# Altium project Electro_plant.PrjPcb
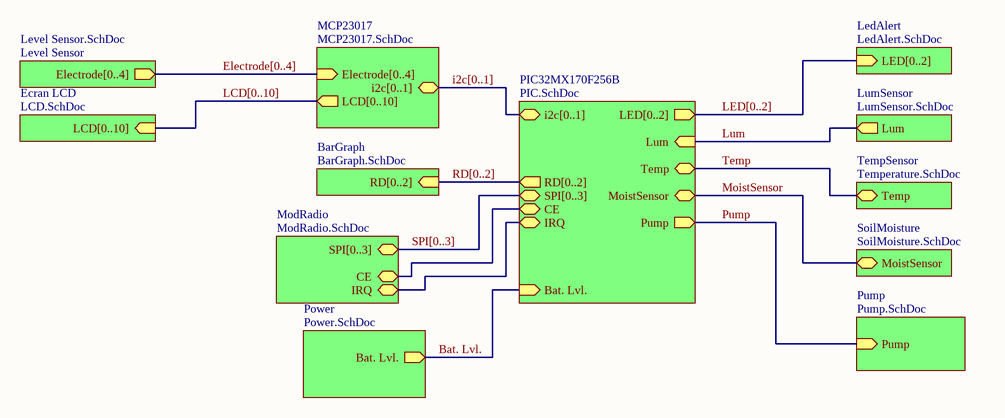
[diagram p0: ElectroPlantoE.SchDoc]
13 sheets, 82 parts. Net scope: hierarchical (ports join the sheet entries above them; power ports are global).
Board file: PCB1.PcbDoc
Sheets:
  ElectroPlantoE.SchDoc
    PIC32MX170F256B = PIC.SchDoc
    LedAlert = LedAlert.SchDoc
    LumSensor = LumSensor.SchDoc
    TempSensor = Temperature.SchDoc
    MCP23017 = MCP23017.SchDoc
    Level Sensor = Level Sensor.SchDoc
    Ecran LCD = LCD.SchDoc
    BarGraph = BarGraph.SchDoc
    SoilMoisture = SoilMoisture.SchDoc
    ModRadio = ModRadio.SchDoc
    Pump = Pump.SchDoc
    Power = Power.SchDoc

## Sheet ElectroPlantoE.SchDoc
size A

### Sub-sheets
BarGraph = BarGraph.SchDoc: RD[0..2] (in)
Ecran LCD = LCD.SchDoc: LCD[0..10] (in)
LedAlert = LedAlert.SchDoc: LED[0..2] (in)
Level Sensor = Level Sensor.SchDoc: Electrode[0..4] (out)
LumSensor = LumSensor.SchDoc: Lum (out)
MCP23017 = MCP23017.SchDoc: i2c[0..1] (bidir), Electrode[0..4] (in), LCD[0..10] (out)
ModRadio = ModRadio.SchDoc: SPI[0..3], CE, IRQ
PIC32MX170F256B = PIC.SchDoc: LED[0..2] (out), Lum (in), Temp (bidir), i2c[0..1] (bidir), RD[0..2] (out), MoistSensor (bidir), Pump (out), SPI[0..3], CE, Bat. Lvl. (in), IRQ
Power = Power.SchDoc: Bat. Lvl. (out)
Pump = Pump.SchDoc: Pump (in)
SoilMoisture = SoilMoisture.SchDoc: MoistSensor (bidir)
TempSensor = Temperature.SchDoc: Temp (bidir)

### Nets
Bat. Lvl.: sheet PIC32MX170F256B/Bat. Lvl., sheet Power/Bat. Lvl.
CE: sheet PIC32MX170F256B/CE, sheet ModRadio/CE
Lum: sheet PIC32MX170F256B/Lum, sheet LumSensor/Lum
MoistSensor: sheet PIC32MX170F256B/MoistSensor, sheet SoilMoisture/MoistSensor
Pump: sheet PIC32MX170F256B/Pump, sheet Pump/Pump
Temp: sheet PIC32MX170F256B/Temp, sheet TempSensor/Temp
NetU4_8: sheet PIC32MX170F256B/IRQ, sheet ModRadio/IRQ

### Buses and harness runs
bus Electrode[0..4] = sheet Level Sensor/Electrode[0..4] = sheet MCP23017/Electrode[0..4]
bus i2c[0..1] = sheet MCP23017/i2c[0..1] = sheet PIC32MX170F256B/i2c[0..1]
bus LCD[0..10] = sheet Ecran LCD/LCD[0..10] = sheet MCP23017/LCD[0..10]
bus LED[0..2] = sheet LedAlert/LED[0..2] = sheet PIC32MX170F256B/LED[0..2]
bus RD[0..2] = sheet BarGraph/RD[0..2] = sheet PIC32MX170F256B/RD[0..2]
bus SPI[0..3] = sheet ModRadio/SPI[0..3] = sheet PIC32MX170F256B/SPI[0..3]

## Sheet PIC.SchDoc
size A
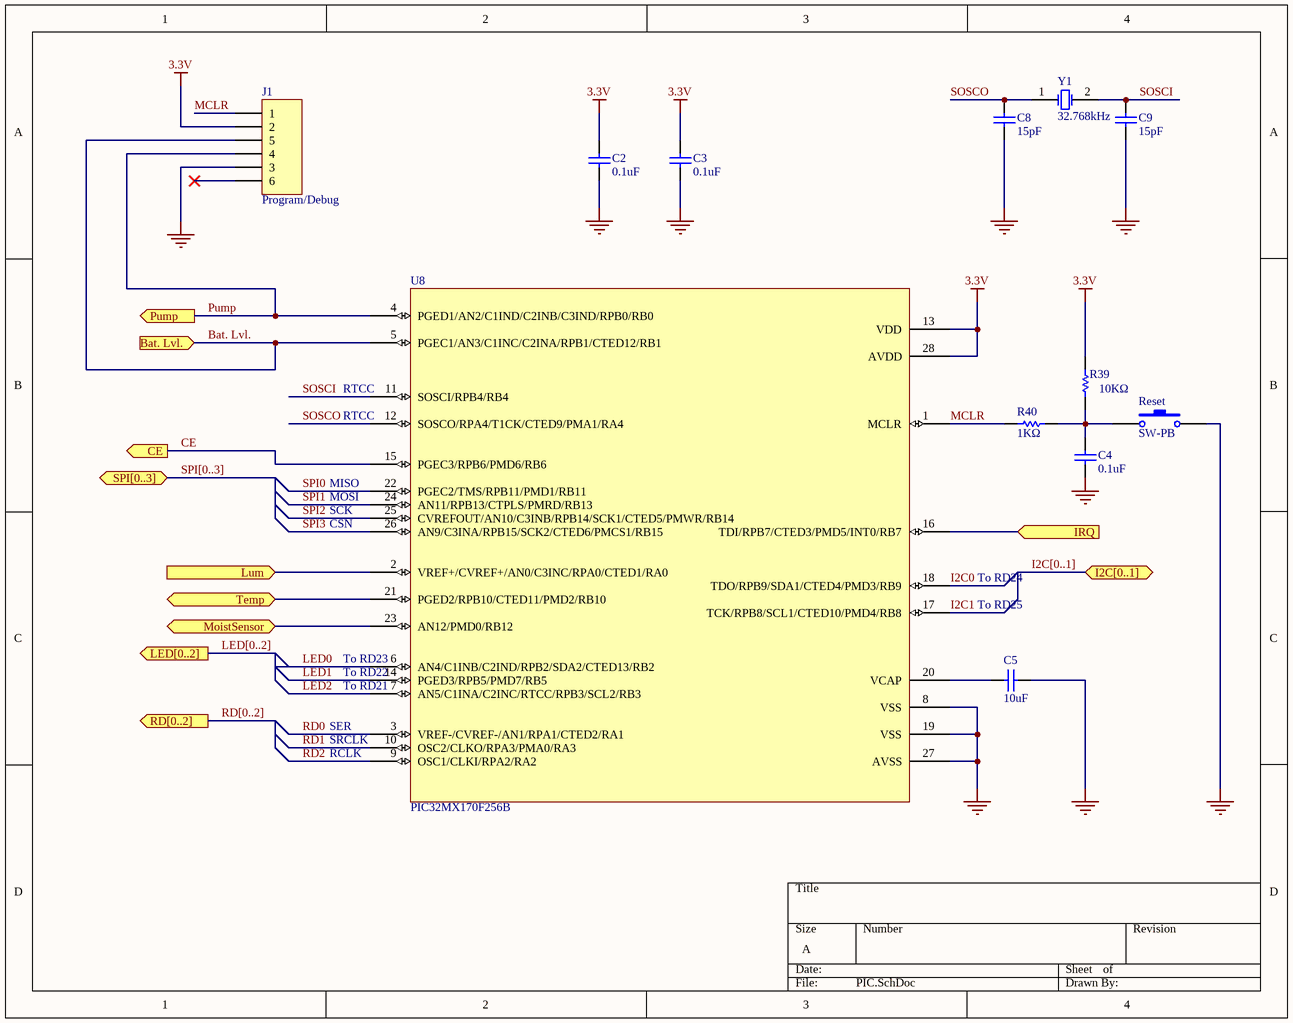
[diagram p1: PIC.SchDoc]

### Parts
C2  0.1uF  [C0603]
C3  0.1uF  [C0603]
C4  0.1uF  [C0603]
C5  10uF  [C0603]
C8  15pF  [C0603]
C9  15pF  [C0603]
J1  Program/Debug  [HDR1X6]
R39  10KΩ  [R0603]
R40  1KΩ  [R0603]
Reset  SW-PB  [Reset]
U8  PIC32MX170F256B  [PIC32MX170F256B]
Y1  32.768kHz  [XTAL]

### Ports
Bat. Lvl. (in), CE (out), I2C[0..1] (bidir), IRQ (in), LED[0..2] (out), Lum (in), MoistSensor (bidir), Pump (out), RD[0..2] (out), SPI[0..3] (bidir), Temp (bidir)

### Nets
3.3V: C2.2 C3.2 J1.2 R39.2 U8.13(VDD) U8.28(AVDD)
GND: C2.1 C3.1 C4.1 C5.2 C8.1 C9.1 J1.3 Reset.2 U8.8(VSS) U8.19(VSS) U8.27(AVSS)
Bat. Lvl.: J1.5 U8.5(PGEC1/AN3/C1INC/C2INA/RPB1/CTED12/RB1) ; port Bat. Lvl.
CE: U8.15(PGEC3/RPB6/PMD6/RB6) ; port CE
I2C0: U8.18(TDO/RPB9/SDA1/CTED4/PMD3/RB9)
I2C1: U8.17(TCK/RPB8/SCL1/CTED10/PMD4/RB8)
LED0: U8.6(AN4/C1INB/C2IND/RPB2/SDA2/CTED13/RB2)
LED1: U8.14(PGED3/RPB5/PMD7/RB5)
LED2: U8.7(AN5/C1INA/C2INC/RTCC/RPB3/SCL2/RB3)
Lum: U8.2(VREF+/CVREF+/AN0/C3INC/RPA0/CTED1/RA0) ; port Lum
MCLR: J1.1 R40.2 U8.1(MCLR)
MoistSensor: U8.23(AN12/PMD0/RB12) ; port MoistSensor
Pump: J1.4 U8.4(PGED1/AN2/C1IND/C2INB/C3IND/RPB0/RB0) ; port Pump
RD0: U8.3(VREF-/CVREF-/AN1/RPA1/CTED2/RA1)
RD1: U8.10(OSC2/CLKO/RPA3/PMA0/RA3)
RD2: U8.9(OSC1/CLKI/RPA2/RA2)
SOSCI: C9.2 U8.11(SOSCI/RPB4/RB4) Y1.2(OSC2)
SOSCO: C8.2 U8.12(SOSCO/RPA4/T1CK/CTED9/PMA1/RA4) Y1.1(OSC1)
SPI0: U8.22(PGEC2/TMS/RPB11/PMD1/RB11)
SPI1: U8.24(AN11/RPB13/CTPLS/PMRD/RB13)
SPI2: U8.25(CVREFOUT/AN10/C3INB/RPB14/SCK1/CTED5/PMWR/RB14)
SPI3: U8.26(AN9/C3INA/RPB15/SCK2/CTED6/PMCS1/RB15)
Temp: U8.21(PGED2/RPB10/CTED11/PMD2/RB10) ; port Temp
NetC4_2: C4.2 R39.1 R40.1 Reset.1
NetC5_1: C5.1 U8.20(VCAP)
NetU4_8: U8.16(TDI/RPB7/CTED3/PMD5/INT0/RB7) ; port IRQ

Not connected (* = marked no-connect by the designer): J1 6*

### Buses and harness runs
bus I2C[0..1] = port I2C[0..1]
bus LED[0..2] = port LED[0..2]
bus RD[0..2] = port RD[0..2]
bus SPI[0..3] = port SPI[0..3]

### Notes on the sheet
- (near U8) RTCC
- MISO
- MOSI
- SCK
- CSN
- To RD24
- To RD25
- (near U8) To RD21
- (near U8) To RD22
- (near U8) To RD23
- SER
- RCLK
- (near U8) SRCLK

### Library data of the parts
C2-C4 = Cap: Capacitor; Manufacturer: MURATA; Ref.Manufacturer: GRM188R71H104KA93; Value: 100pF; Published: 8-Jun-2000; LatestRevisionDate: 17-Jul-2002; LatestRevisionNote: Re-released for DXP Platform.; PackageReference: RAD-0.3; Publisher: Altium Limited; PackageDescription: Radial Cap, Thru-Hole; 2 Leads; 0.3 in Pin Spacing; Ref.Farnell: 8820023; Supplier: Farnell
C5 = Cap: Capacitor; Manufacturer: MURATA; Ref.Manufacturer: GRM188D71A106MA73; Value: 100pF; Published: 8-Jun-2000; LatestRevisionDate: 17-Jul-2002; LatestRevisionNote: Re-released for DXP Platform.; PackageReference: RAD-0.3; Publisher: Altium Limited; PackageDescription: Radial Cap, Thru-Hole; 2 Leads; 0.3 in Pin Spacing; Ref.Farnell: 2611920; Supplier: Farnell
C8 C9 = Cap: Capacitor; Manufacturer: MURATA; Ref.Manufacturer: GRM1885C1H150JA01; Value: 27pF; Published: 8-Jun-2000; LatestRevisionDate: 17-Jul-2002; LatestRevisionNote: Re-released for DXP Platform.; PackageReference: RAD-0.3; Publisher: Altium Limited; PackageDescription: Radial Cap, Thru-Hole; 2 Leads; 0.3 in Pin Spacing; Ref.Farnell: 8819823; Supplier: Farnell
J1 = Header 6: Header, 6-Pin; LatestRevisionDate: 17-Jul-2002; LatestRevisionNote: Re-released for DXP Platform.; Publisher: Altium Limited; Supplier: Farnell
R39 = Res1: Resistor; Manufacturer: MULTICOMP; Ref.Manufacturer: MC0063W0603110K; Value: 1K; Published: 8-Jun-2000; LatestRevisionDate: 17-Jul-2002; LatestRevisionNote: Re-released for DXP Platform.; PackageReference: AXIAL-0.3; Publisher: Altium Limited; PackageDescription: Axial Device, Thru-Hole; 2 Leads; 0.3 in Pin Spacing; Ref.Farnell: 9330399; Supplier: Farnell
R40 = Res1: Resistor; Manufacturer: MULTICOMP; Ref.Manufacturer: MC0063W060311K; Value: 1K; Published: 8-Jun-2000; LatestRevisionDate: 17-Jul-2002; LatestRevisionNote: Re-released for DXP Platform.; PackageReference: AXIAL-0.3; Publisher: Altium Limited; PackageDescription: Axial Device, Thru-Hole; 2 Leads; 0.3 in Pin Spacing; Ref.Farnell: 9330380; Supplier: Farnell
Reset = SW-PB: Switch; Manufacturer: ALCOSWITCH - TE CONNECTIVITY; Ref.Manufacturer: 1437566-3; Published: 24-Mar-1999; LatestRevisionDate: 17-Jul-2002; LatestRevisionNote: Re-released for DXP Platform.; PackageReference: SPST-2; Publisher: Altium Limited; PackageDescription: Switch; 2 Leads; Ref.Farnell: 2468741; Supplier: Farnell
U8 = PIC32MX170F256B: Pic; Manufacturer: MICROCHIP; Ref.Manufacturer: PIC32MX170F256B-I/SO; Ref.Farnell: 2449077; Supplier: Farnell
Y1 = XTAL: Crystal Oscillator; Manufacturer: ABRACON; Ref.Manufacturer: AB38T-32.768KHZ; Published: 8-Jun-2000; LatestRevisionDate: 17-Jul-2002; LatestRevisionNote: Re-released for DXP Platform.; PackageReference: R38; Publisher: Altium Limited; PackageDescription: Crystal, Thru-Hole; 2 Leads; Body 3.1 x 8.2 mm (Dia.xH); Ref.Farnell: 1611828; Supplier: Farnell

## Sheet LedAlert.SchDoc
size A
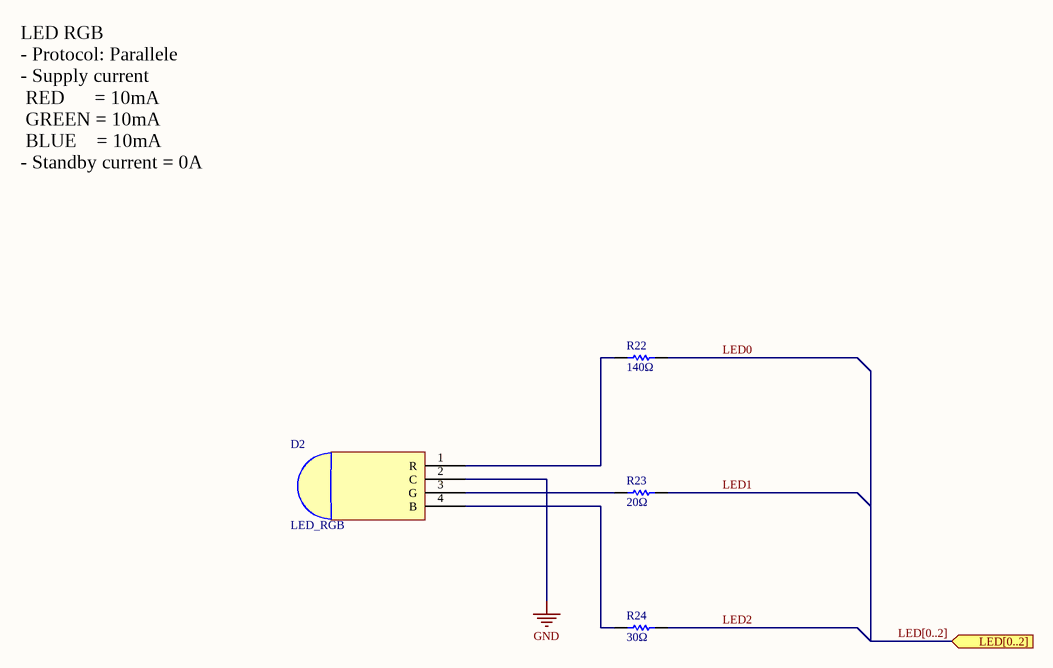
[diagram p2: LedAlert.SchDoc]

### Parts
D2  LED_RGB  [LED1]
R22  140Ω  [R0603]
R23  20Ω  [R0603]
R24  30Ω  [R0603]

### Ports
LED[0..2] (in)

### Nets
GND: D2.2(C)
LED0: R22.2
LED1: R23.2
LED2: R24.2
NetD2_1: D2.1(R) R22.1
NetD2_3: D2.3(G) R23.1
NetD2_4: D2.4(B) R24.1

### Buses and harness runs
bus LED[0..2] = port LED[0..2]

### Notes on the sheet
- LED RGB
  - Protocol: Parallele
  - Supply current
  RED      = 10mA
  GREEN = 10mA
  BLUE    = 10mA
  - Standby current = 0A

### Library data of the parts
D2 = LED_RGB: LedRGB; Manufacturer: KINGBRIGHT; Ref.Manufacturer: L-154A4SURKQBDZGW; Ref.Farnell: 2290374; Supplier: Farnell
R22 = Res1: Resistor; Manufacturer: MULTICOMP; Value: 1K; Published: 8-Jun-2000; LatestRevisionDate: 17-Jul-2002; LatestRevisionNote: Re-released for DXP Platform.; PackageReference: AXIAL-0.3; Publisher: Altium Limited; PackageDescription: Axial Device, Thru-Hole; 2 Leads; 0.3 in Pin Spacing; Ref.Farnell: ?; Supplier: Farnell
R23 = Res1: Resistor; Manufacturer: MULTICOMP; Ref.Manufacturer: MC0063W0603120R; Value: 1K; Published: 8-Jun-2000; LatestRevisionDate: 17-Jul-2002; LatestRevisionNote: Re-released for DXP Platform.; PackageReference: AXIAL-0.3; Publisher: Altium Limited; PackageDescription: Axial Device, Thru-Hole; 2 Leads; 0.3 in Pin Spacing; Ref.Farnell: 9330798; Supplier: Farnell
R24 = Res1: Resistor; Manufacturer: MULTICOMP; Ref.Manufacturer: MC0063W0603130R; Value: 1K; Published: 8-Jun-2000; LatestRevisionDate: 17-Jul-2002; LatestRevisionNote: Re-released for DXP Platform.; PackageReference: AXIAL-0.3; Publisher: Altium Limited; PackageDescription: Axial Device, Thru-Hole; 2 Leads; 0.3 in Pin Spacing; Ref.Farnell: 9331000; Supplier: Farnell

## Sheet LumSensor.SchDoc
size A
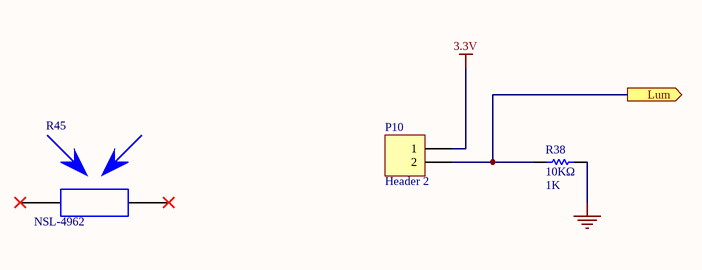
[diagram p3: LumSensor.SchDoc]

### Parts
P10  Header 2  [BORNIER]
R38  10KΩ  value 1K  [R0603]
R45  NSL-4962  [NSL-4962]

### Ports
Lum (out)

### Nets
3.3V: P10.1
GND: R38.2
Lum: P10.2 R38.1 ; port Lum

Not connected (* = marked no-connect by the designer): R45 1* 2*

### Library data of the parts
P10 = Header 2: Header, 2-Pin; Manufacturer: BUCHANAN - TE CONNECTIVITY; Ref.Manufacturer: 282834-2; LatestRevisionDate: 17-Jul-2002; LatestRevisionNote: Re-released for DXP Platform.; Publisher: Altium Limited; Ref.Farnell: 2112482; Supplier: Farnell
R38 = Res1: Resistor; Published: 8-Jun-2000; LatestRevisionDate: 17-Jul-2002; LatestRevisionNote: Re-released for DXP Platform.; PackageReference: AXIAL-0.3; Publisher: Altium Limited; PackageDescription: Axial Device, Thru-Hole; 2 Leads; 0.3 in Pin Spacing; Supplier: Farnell
R45 = NSL-4962: Ldr; Manufacturer: ADVANCED PHOTONIX; Ref.Manufacturer: NSL 4962.; Ref.Farnell: 3168359; Supplier: Farnell

## Sheet Temperature.SchDoc
size A
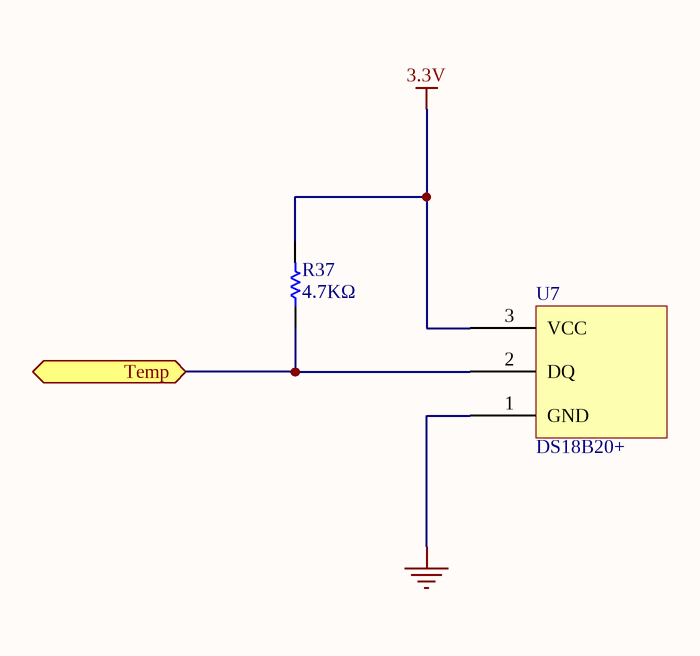
[diagram p4: Temperature.SchDoc]

### Parts
R37  4.7KΩ  [R0603]
U7  DS18B20+  [DS18B20+]

### Ports
Temp (bidir)

### Nets
3.3V: R37.2 U7.3(VCC)
GND: U7.1(GND)
Temp: R37.1 U7.2(DQ) ; port Temp

### Library data of the parts
R37 = Res1: Resistor; Manufacturer: MULTICOMP; Ref.Manufacturer: MC0063W060314K7; Value: 1K; Published: 8-Jun-2000; LatestRevisionDate: 17-Jul-2002; LatestRevisionNote: Re-released for DXP Platform.; PackageReference: AXIAL-0.3; Publisher: Altium Limited; PackageDescription: Axial Device, Thru-Hole; 2 Leads; 0.3 in Pin Spacing; Ref.Farnell: 9331247; Supplier: Farnell
U7 = DS18B20+: Temp; Manufacturer: MAXIM INTEGRATED PRODUCTS; Ref.Farnell: 2515553; Ref.Manufacturer: DS18B20+; Supplier: Farnell

## Sheet MCP23017.SchDoc
size A
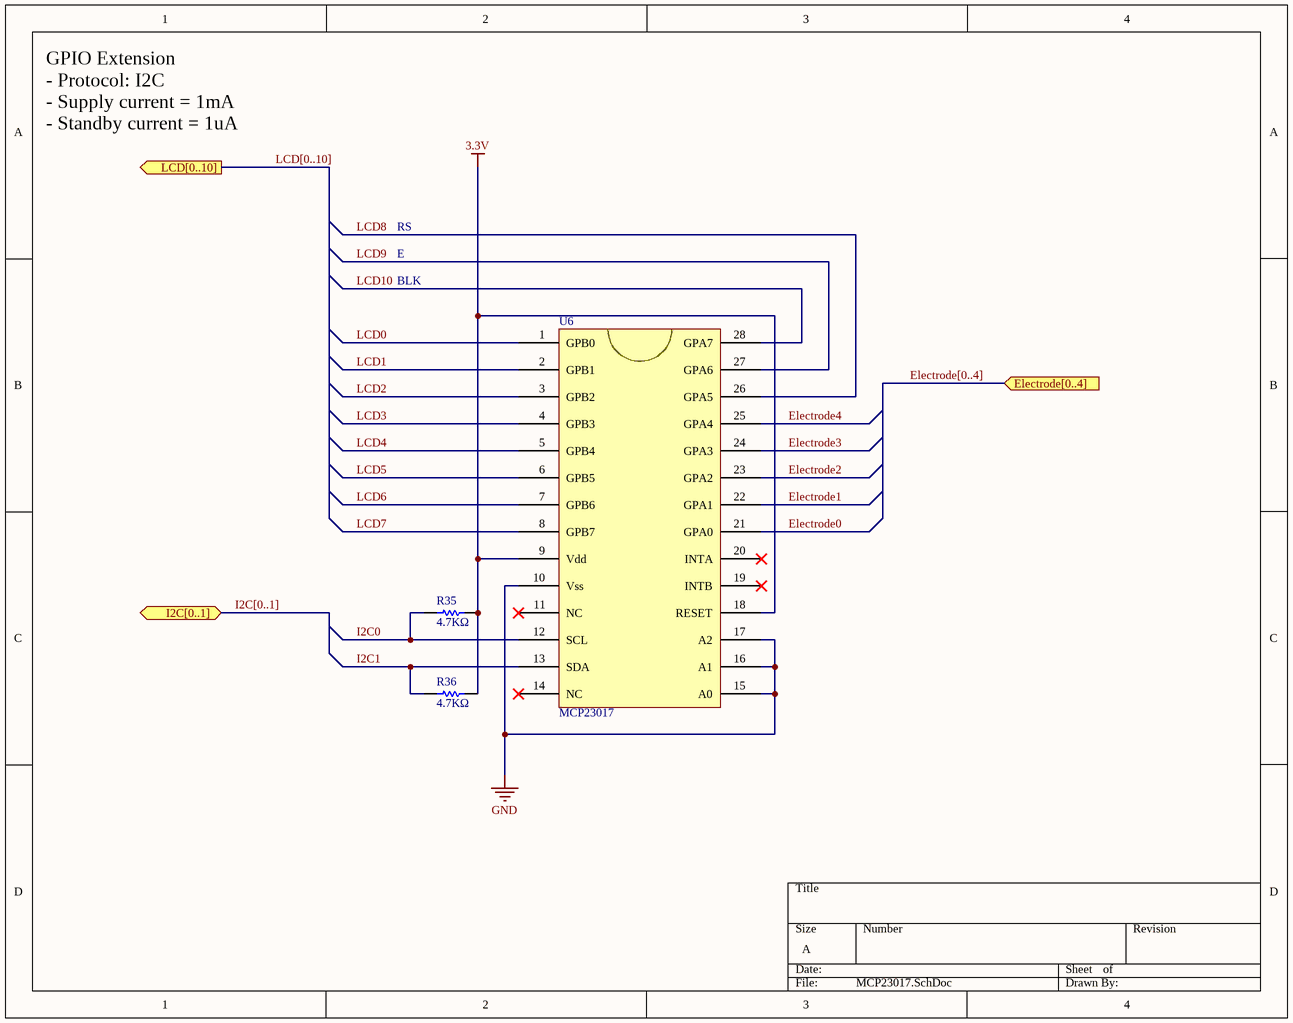
[diagram p5: MCP23017.SchDoc]

### Parts
R35  4.7KΩ  [R0603]
R36  4.7KΩ  [R0603]
U6  MCP23017  [MCP23017]

### Ports
Electrode[0..4] (in), I2C[0..1] (bidir), LCD[0..10] (out)

### Nets
3.3V: R35.2 R36.2 U6.9(Vdd) U6.18(RESET)
GND: U6.10(Vss) U6.15(A0) U6.16(A1) U6.17(A2)
Electrode0: U6.21(GPA0)
Electrode1: U6.22(GPA1)
Electrode2: U6.23(GPA2)
Electrode3: U6.24(GPA3)
Electrode4: U6.25(GPA4)
I2C0: R35.1 U6.12(SCL)
I2C1: R36.1 U6.13(SDA)
LCD0: U6.1(GPB0)
LCD1: U6.2(GPB1)
LCD2: U6.3(GPB2)
LCD3: U6.4(GPB3)
LCD4: U6.5(GPB4)
LCD5: U6.6(GPB5)
LCD6: U6.7(GPB6)
LCD7: U6.8(GPB7)
LCD8: U6.26(GPA5)
LCD9: U6.27(GPA6)
LCD10: U6.28(GPA7)

Not connected (* = marked no-connect by the designer): U6 11(NC)* 14(NC)* 19(INTB)* 20(INTA)*

### Buses and harness runs
bus Electrode[0..4] = port Electrode[0..4]
bus I2C[0..1] = port I2C[0..1]
bus LCD[0..10] = port LCD[0..10]

### Notes on the sheet
- GPIO Extension
  - Protocol: I2C
  - Supply current = 1mA
  - Standby current = 1uA
- RS
- E
- BLK

### Library data of the parts
R35 R36 = Res1: as R37 on sheet Temperature; Published: 8-Jun-2000; LatestRevisionDate: 17-Jul-2002; LatestRevisionNote: Re-released for DXP Platform.; PackageReference: AXIAL-0.3; Publisher: Altium Limited; PackageDescription: Axial Device, Thru-Hole; 2 Leads; 0.3 in Pin Spacing; Ref.Farnell: 9331247; Supplier: Farnell
U6 = MPC23017: GPIOExpander; Manufacturer: MICROCHIP; Ref.Manufacturer: MCP23017-E/SO; Ref.Farnell: 1332087; Supplier: Farnell

## Sheet Level Sensor.SchDoc
size A
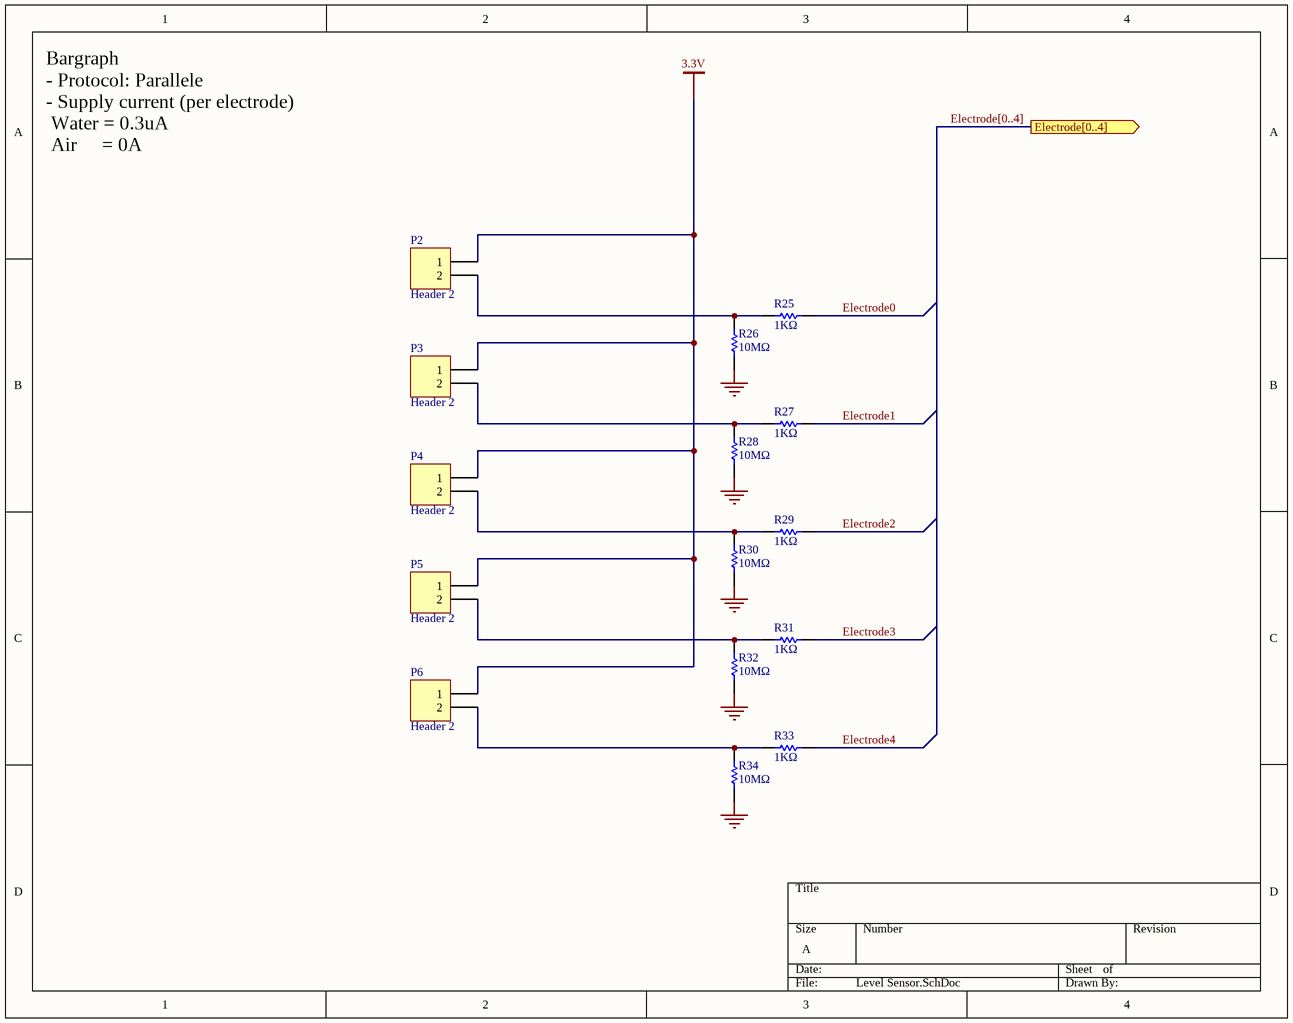
[diagram p6: Level Sensor.SchDoc]

### Parts
P2  Header 2  [BORNIER]
P3  Header 2  [BORNIER]
P4  Header 2  [BORNIER]
P5  Header 2  [BORNIER]
P6  Header 2  [BORNIER]
R25  1KΩ  [R0603]
R26  10MΩ  [R0603]
R27  1KΩ  [R0603]
R28  10MΩ  [R0603]
R29  1KΩ  [R0603]
R30  10MΩ  [R0603]
R31  1KΩ  [R0603]
R32  10MΩ  [R0603]
R33  1KΩ  [R0603]
R34  10MΩ  [R0603]

### Ports
Electrode[0..4] (out)

### Nets
3.3V: P2.1 P3.1 P4.1 P5.1 P6.1
GND: R26.1 R28.1 R30.1 R32.1 R34.1
Electrode0: R25.2
Electrode1: R27.2
Electrode2: R29.2
Electrode3: R31.2
Electrode4: R33.2
NetP2_2: P2.2 R25.1 R26.2
NetP3_2: P3.2 R27.1 R28.2
NetP4_2: P4.2 R29.1 R30.2
NetP5_2: P5.2 R31.1 R32.2
NetP6_2: P6.2 R33.1 R34.2

### Buses and harness runs
bus Electrode[0..4] = port Electrode[0..4]

### Notes on the sheet
- Bargraph
  - Protocol: Parallele
  - Supply current (per electrode)
  Water = 0.3uA
  Air     = 0A

### Library data of the parts
P2-P6 = Header 2: as P10 on sheet LumSensor; LatestRevisionDate: 17-Jul-2002; LatestRevisionNote: Re-released for DXP Platform.; Publisher: Altium Limited; Ref.Farnell: 2112482; Supplier: Farnell
R25 R27 R29 R31 R33 = Res1: as R40 on sheet PIC; Published: 8-Jun-2000; LatestRevisionDate: 17-Jul-2002; LatestRevisionNote: Re-released for DXP Platform.; PackageReference: AXIAL-0.3; Publisher: Altium Limited; PackageDescription: Axial Device, Thru-Hole; 2 Leads; 0.3 in Pin Spacing; Ref.Farnell: 9330380; Supplier: Farnell
R26 R28 R30 R32 R34 = Res1: as R22 on sheet LedAlert; Published: 8-Jun-2000; LatestRevisionDate: 17-Jul-2002; LatestRevisionNote: Re-released for DXP Platform.; PackageReference: AXIAL-0.3; Publisher: Altium Limited; PackageDescription: Axial Device, Thru-Hole; 2 Leads; 0.3 in Pin Spacing; Ref.Farnell: ?; Supplier: Farnell

## Sheet LCD.SchDoc
size A
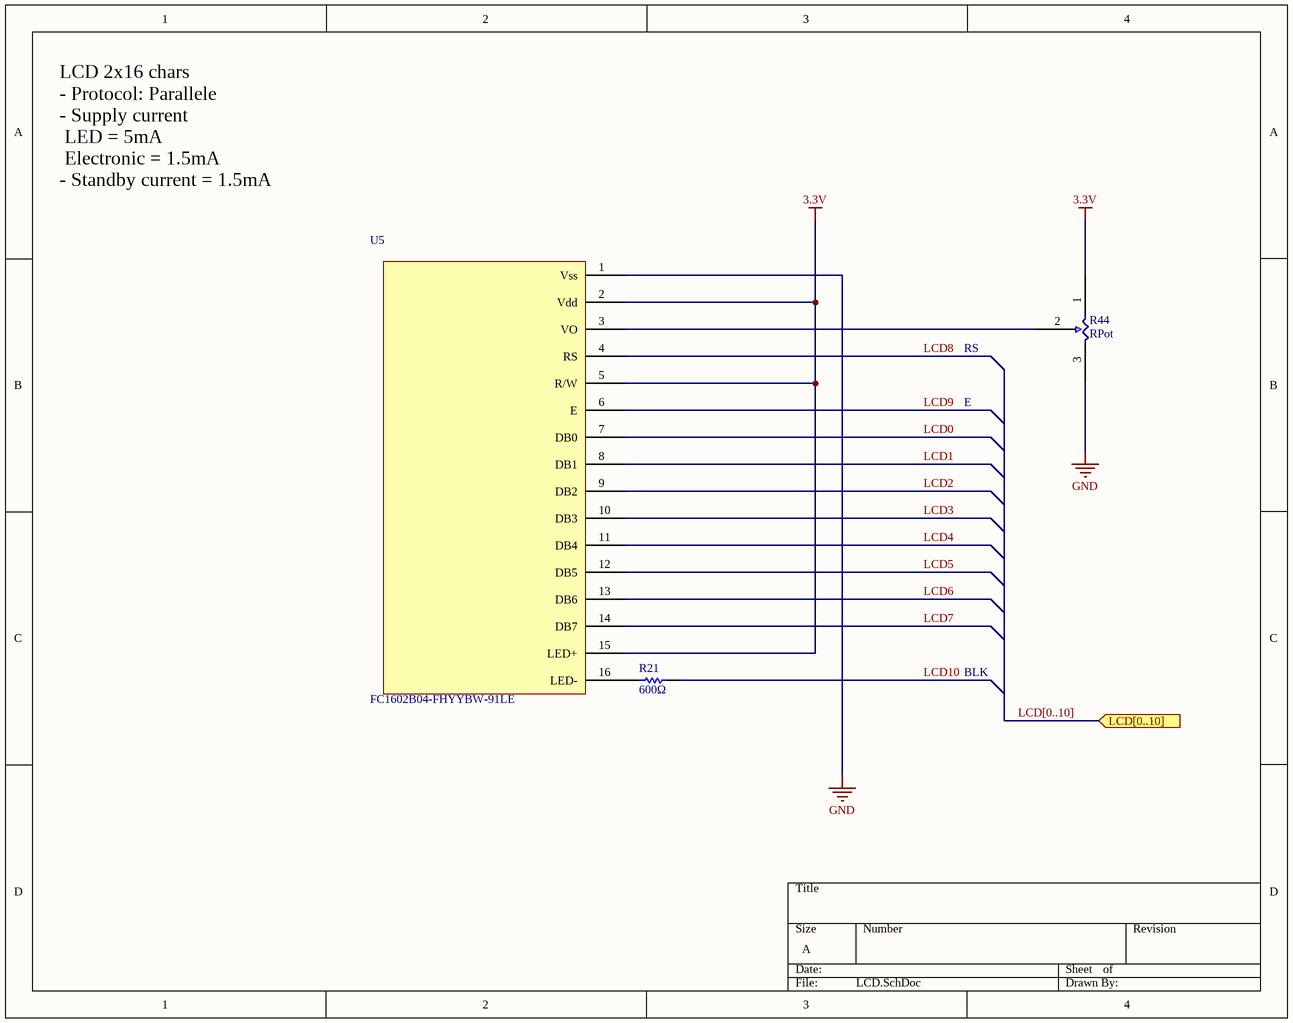
[diagram p7: LCD.SchDoc]

### Parts
R21  600Ω  [R0603]
R44  RPot  [POTARD]
U5  FC1602B04-FHYYBW-91LE  [FC1602B04-FHYYBW-91LE]

### Ports
LCD[0..10] (in)

### Nets
3.3V: R44.1 U5.2(Vdd) U5.5(R/W) U5.15(LED+)
GND: R44.3 U5.1(Vss)
LCD0: U5.7(DB0)
LCD1: U5.8(DB1)
LCD2: U5.9(DB2)
LCD3: U5.10(DB3)
LCD4: U5.11(DB4)
LCD5: U5.12(DB5)
LCD6: U5.13(DB6)
LCD7: U5.14(DB7)
LCD8: U5.4(RS)
LCD9: U5.6(E)
LCD10: R21.2
NetR21_1: R21.1 U5.16(LED-)
NetR44_2: R44.2 U5.3(VO)

### Buses and harness runs
bus LCD[0..10] =  = port LCD[0..10]

### Notes on the sheet
- LCD 2x16 chars
  - Protocol: Parallele
  - Supply current
  LED	= 5mA
  Electronic	= 1.5mA
  - Standby current = 1.5mA
- RS
- E
- BLK

### Library data of the parts
R21 = Res1: as R22 on sheet LedAlert; Published: 8-Jun-2000; LatestRevisionDate: 17-Jul-2002; LatestRevisionNote: Re-released for DXP Platform.; PackageReference: AXIAL-0.3; Publisher: Altium Limited; PackageDescription: Axial Device, Thru-Hole; 2 Leads; 0.3 in Pin Spacing; Ref.Farnell: ?; Supplier: Farnell
R44 = Potard: Varistor; Manufacturer: VISHAY; Ref.Manufacturer: T73YE103KT20; Ref.Farnell: 2550676; Supplier: Farnell
U5 = FC1602B04-FHYYBW-91LE: LCD; Manufacturer: FORDATA; Ref.Farnell: 2674137; Ref.Manufacturer: FC1602B04-FHYYBW-91LE; Supplier: Farnell

## Sheet BarGraph.SchDoc
size A
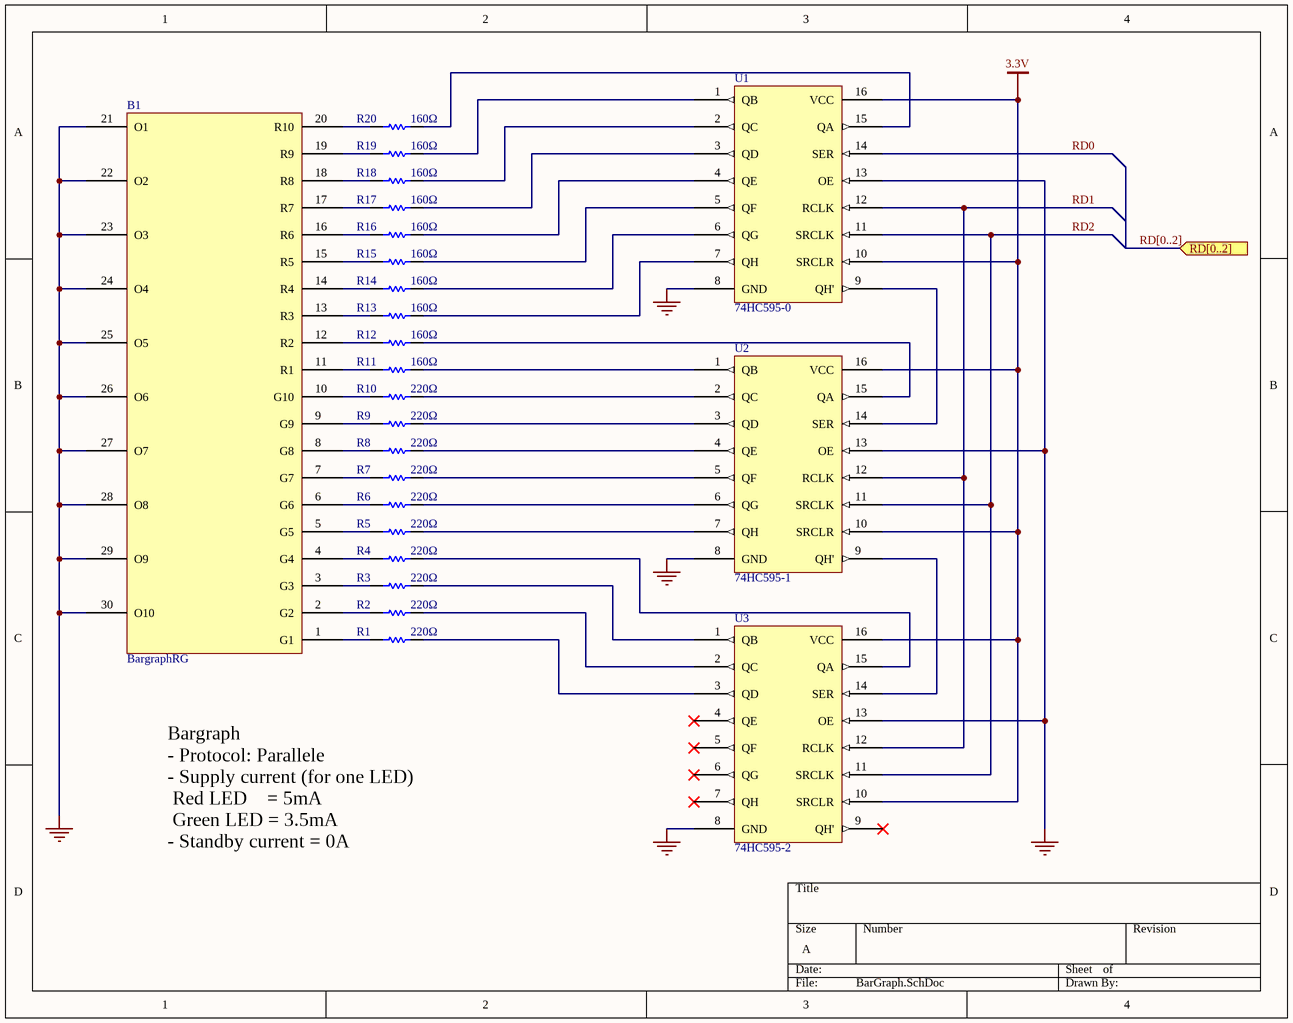
[diagram p8: BarGraph.SchDoc]

### Parts
B1  BargraphRG  [BargraphRG]
R1  220Ω  [R0603]
R2  220Ω  [R0603]
R3  220Ω  [R0603]
R4  220Ω  [R0603]
R5  220Ω  [R0603]
R6  220Ω  [R0603]
R7  220Ω  [R0603]
R8  220Ω  [R0603]
R9  220Ω  [R0603]
R10  220Ω  [R0603]
R11  160Ω  [R0603]
R12  160Ω  [R0603]
R13  160Ω  [R0603]
R14  160Ω  [R0603]
R15  160Ω  [R0603]
R16  160Ω  [R0603]
R17  160Ω  [R0603]
R18  160Ω  [R0603]
R19  160Ω  [R0603]
R20  160Ω  [R0603]
U1  74HC595-0  [SN74HC595D]
U2  74HC595-1  [SN74HC595D]
U3  74HC595-2  [SN74HC595D]

### Ports
RD[0..2] (in)

### Nets
3.3V: U1.10(SRCLR) U1.16(VCC) U2.10(SRCLR) U2.16(VCC) U3.10(SRCLR) U3.16(VCC)
GND: B1.21(O1) B1.22(O2) B1.23(O3) B1.24(O4) B1.25(O5) B1.26(O6) B1.27(O7) B1.28(O8) B1.29(O9) B1.30(O10) U1.8(GND) U1.13(OE) U2.8(GND) U2.13(OE) U3.8(GND) U3.13(OE)
RD0: U1.14(SER)
RD1: U1.12(RCLK) U2.12(RCLK) U3.12(RCLK)
RD2: U1.11(SRCLK) U2.11(SRCLK) U3.11(SRCLK)
NetB1_1: B1.1(G1) R1.1
NetB1_2: B1.2(G2) R2.1
NetB1_3: B1.3(G3) R3.1
NetB1_4: B1.4(G4) R4.1
NetB1_5: B1.5(G5) R5.1
NetB1_6: B1.6(G6) R6.1
NetB1_7: B1.7(G7) R7.1
NetB1_8: B1.8(G8) R8.1
NetB1_9: B1.9(G9) R9.1
NetB1_10: B1.10(G10) R10.1
NetB1_11: B1.11(R1) R11.1
NetB1_12: B1.12(R2) R12.1
NetB1_13: B1.13(R3) R13.1
NetB1_14: B1.14(R4) R14.1
NetB1_15: B1.15(R5) R15.1
NetB1_16: B1.16(R6) R16.1
NetB1_17: B1.17(R7) R17.1
NetB1_18: B1.18(R8) R18.1
NetB1_19: B1.19(R9) R19.1
NetB1_20: B1.20(R10) R20.1
NetR1_2: R1.2 U3.3(QD)
NetR2_2: R2.2 U3.2(QC)
NetR3_2: R3.2 U3.1(QB)
NetR4_2: R4.2 U3.15(QA)
NetR5_2: R5.2 U2.7(QH)
NetR6_2: R6.2 U2.6(QG)
NetR7_2: R7.2 U2.5(QF)
NetR8_2: R8.2 U2.4(QE)
NetR9_2: R9.2 U2.3(QD)
NetR10_2: R10.2 U2.2(QC)
NetR11_2: R11.2 U2.1(QB)
NetR12_2: R12.2 U2.15(QA)
NetR13_2: R13.2 U1.7(QH)
NetR14_2: R14.2 U1.6(QG)
NetR15_2: R15.2 U1.5(QF)
NetR16_2: R16.2 U1.4(QE)
NetR17_2: R17.2 U1.3(QD)
NetR18_2: R18.2 U1.2(QC)
NetR19_2: R19.2 U1.1(QB)
NetR20_2: R20.2 U1.15(QA)
NetU1_9: U1.9(QH') U2.14(SER)
NetU2_9: U2.9(QH') U3.14(SER)

Not connected (* = marked no-connect by the designer): U3 4(QE)* 5(QF)* 6(QG)* 7(QH)* 9(QH')*

### Buses and harness runs
bus RD[0..2] = port RD[0..2]

### Notes on the sheet
- Bargraph
  - Protocol: Parallele
  - Supply current (for one LED)
  Red LED    = 5mA
  Green LED = 3.5mA
  - Standby current = 0A

### Library data of the parts
B1 = BargraphRG: Bargraph; Manufacturer: KINGBRIGHT; Ref.Manufacturer: DC-10EGWA; Ref.Farnell: 2290326; Supplier: Farnell
R1-R20 = Res1: Resistor; Value: 1K; Published: 8-Jun-2000; LatestRevisionDate: 17-Jul-2002; LatestRevisionNote: Re-released for DXP Platform.; PackageReference: AXIAL-0.3; Publisher: Altium Limited; PackageDescription: Axial Device, Thru-Hole; 2 Leads; 0.3 in Pin Spacing; Supplier: Farnell
U1-U3 = 74HC595: ShiftRegister; Manufacturer: TEXAS INSTRUMENTS; Ref.Manufacturer: SN74HC595DR; Ref.Farnell: 1607849; Supplier: Farnell

## Sheet SoilMoisture.SchDoc
size A
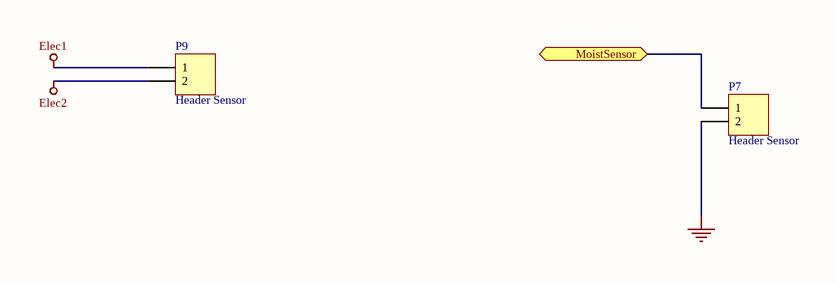
[diagram p9: SoilMoisture.SchDoc]

### Parts
P7  Header Sensor  [BORNIER]
P9  Header Sensor  [BORNIER]

### Ports
MoistSensor (bidir)

### Nets
Elec1: P9.1
Elec2: P9.2
GND: P7.2
MoistSensor: P7.1 ; port MoistSensor

### Library data of the parts
P7 P9 = Header 2: as P10 on sheet LumSensor; LatestRevisionDate: 17-Jul-2002; LatestRevisionNote: Re-released for DXP Platform.; Publisher: Altium Limited; Ref.Farnell: 2112482; Supplier: Farnell

## Sheet ModRadio.SchDoc
size A
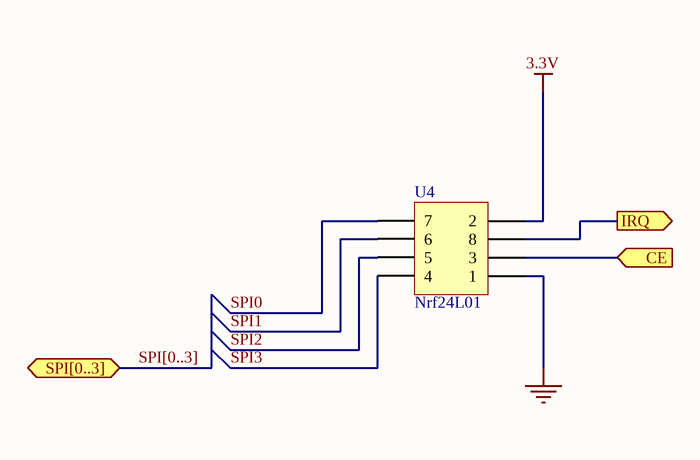
[diagram p10: ModRadio.SchDoc]

### Parts
U4  Nrf24L01  [NRF24L01]

### Ports
CE (in), IRQ (out), SPI[0..3] (bidir)

### Nets
3.3V: U4.2
GND: U4.1
CE: U4.3 ; port CE
SPI0: U4.7
SPI1: U4.6
SPI2: U4.5
SPI3: U4.4
NetU4_8: U4.8 ; port IRQ

### Buses and harness runs
bus SPI[0..3] = port SPI[0..3]

### Library data of the parts
U4 = Header 4X2: Header, 4-Pin, Dual row; Manufacturer: /; LatestRevisionDate: 17-Jul-2002; LatestRevisionNote: Re-released for DXP Platform.; Publisher: Altium Limited; Ref.Farnell: /; Ref.Manufacturer: /; Supplier: /

## Sheet Pump.SchDoc
size A
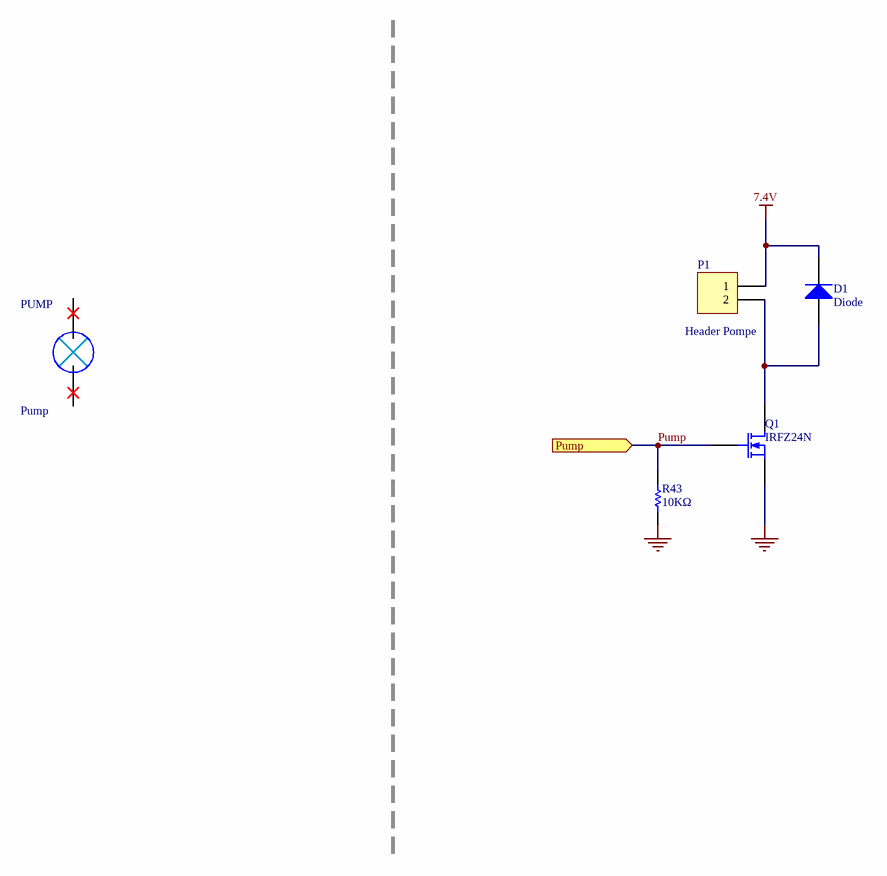
[diagram p11: Pump.SchDoc]

### Parts
D1  Diode  [SMC]
P1  Header Pompe  [BORNIER]
PUMP  Pump
Q1  IRFZ24N  [E3]
R43  10KΩ  [R0603]

### Ports
Pump (in)

### Nets
7.4V: D1.2(K) P1.1
GND: Q1.3(S) R43.2
Pump: Q1.2(G) R43.1 ; port Pump
NetD1_1: D1.1(A) P1.2 Q1.1(D)

Not connected (* = marked no-connect by the designer): PUMP 1 2

### Library data of the parts
P1 = Header 2: as P10 on sheet LumSensor; LatestRevisionDate: 17-Jul-2002; LatestRevisionNote: Re-released for DXP Platform.; Publisher: Altium Limited; Ref.Farnell: 2112482; Supplier: Farnell
PUMP = Pump: Manufacturer: /; Ref.Farnell: /; Ref.Manufacturer: /; Supplier: /
Q1 = MOSFET-N: N-Channel MOSFET; Manufacturer: INFINEON; Ref.Manufacturer: IRFZ24NPBF; Published: 8-Jun-2000; LatestRevisionDate: 17-Jul-2002; LatestRevisionNote: Re-released for DXP Platform.; PackageVersion: 1995/1996; PackageReference: E3; Publisher: Altium Limited; PackageDescription: TO, Flat Index; 3 In-Line, Axial Leads; Body Dia. 4.6mm; Lead Dia. 0.5 mm (max); Ref.Farnell: 8650160; Supplier: Farnell
R43 = Res1: as R39 on sheet PIC; Published: 8-Jun-2000; LatestRevisionDate: 17-Jul-2002; LatestRevisionNote: Re-released for DXP Platform.; PackageReference: AXIAL-0.3; Publisher: Altium Limited; PackageDescription: Axial Device, Thru-Hole; 2 Leads; 0.3 in Pin Spacing; Ref.Farnell: 9330399; Supplier: Farnell
D1 = Diode: Published: 8-Jun-2000; LatestRevisionDate: 17-Jul-2002; LatestRevisionNote: Re-released for DXP Platform.; PackageVersion: Sep-1996; PackageReference: SMC; Publisher: Altium Limited; PackageDescription: DO-214-AB/SMC; 2 C-Bend Leads; Body 7.9 x 5.9 mm, inc. leads (LxW); Code_JEDEC: DO-214-AB; Supplier: Farnell

## Sheet Power.SchDoc
size A
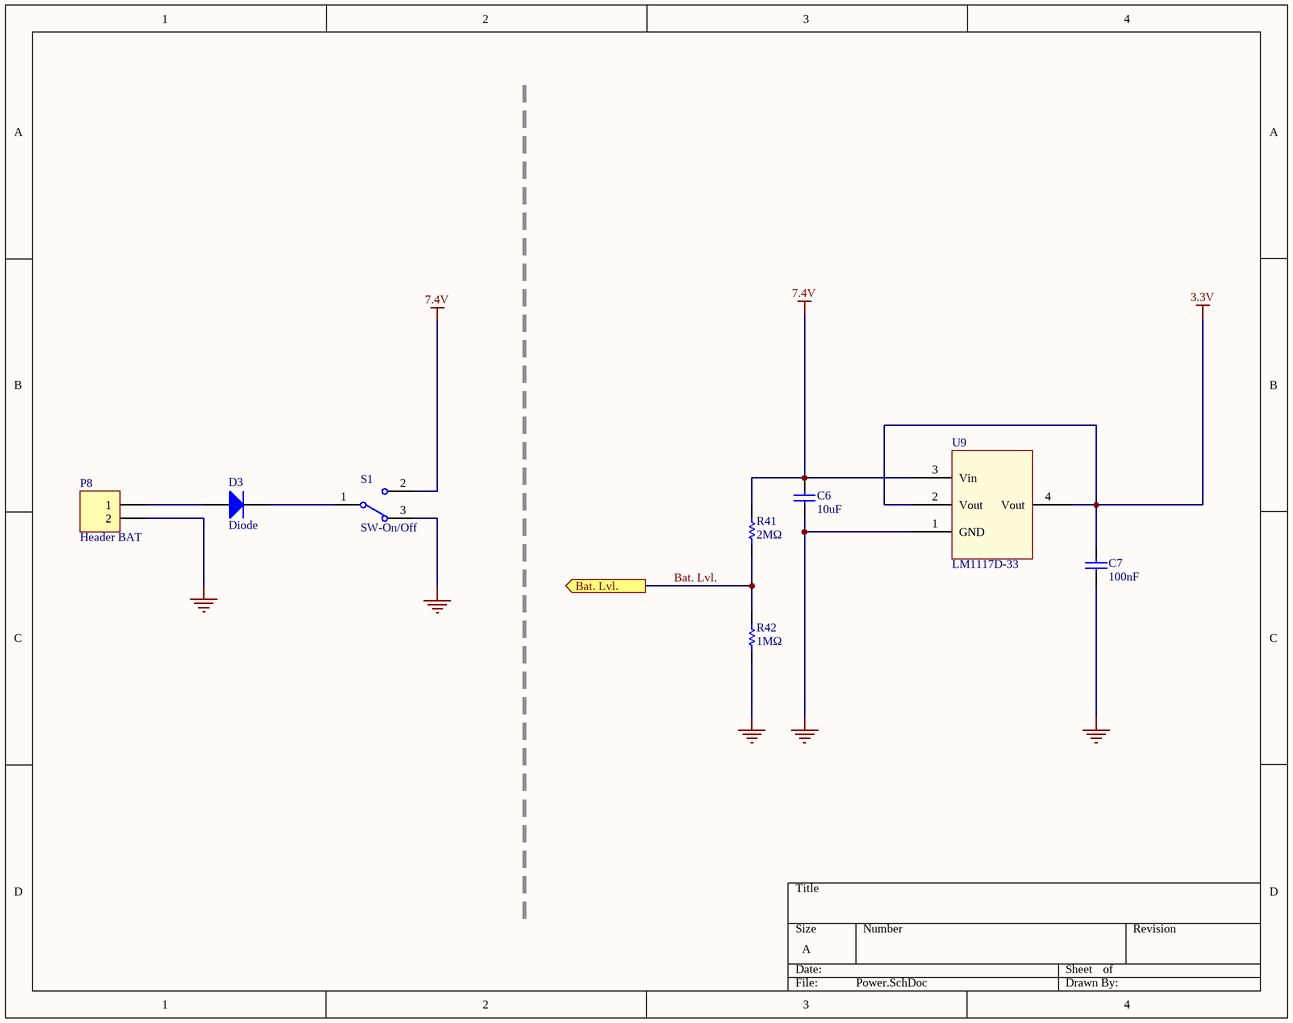
[diagram p12: Power.SchDoc]

### Parts
C6  10uF  [C0603]
C7  100nF  [C0603]
D3  Diode  [SMC]
P8  Header BAT  [BORNIER]
R41  2MΩ  [R0603]
R42  1MΩ  [R0603]
S1  SW-On/Off  [Switch on/off]
U9  LM1117D-33  [VoltReg3.3V]

### Ports
Bat. Lvl. (out)

### Nets
3.3V: C7.2 U9.2(Vout) U9.4(Vout)
7.4V: C6.2 R41.2 S1.2 U9.3(Vin)
GND: C6.1 C7.1 P8.2 R42.1 S1.3 U9.1(GND)
Bat. Lvl.: R41.1 R42.2 ; port Bat. Lvl.
NetD3_1: D3.1(A) P8.1
NetD3_2: D3.2(K) S1.1

### Library data of the parts
C6 = Cap: as C5 on sheet PIC; Published: 8-Jun-2000; LatestRevisionDate: 17-Jul-2002; LatestRevisionNote: Re-released for DXP Platform.; PackageReference: RAD-0.3; Publisher: Altium Limited; PackageDescription: Radial Cap, Thru-Hole; 2 Leads; 0.3 in Pin Spacing; Ref.Farnell: 2611920; Supplier: Farnell
C7 = Cap: Capacitor; Manufacturer: MURATA; Ref.Manufacturer: ?/GRM188R71H104KA93; Value: 100pF; Published: 8-Jun-2000; LatestRevisionDate: 17-Jul-2002; LatestRevisionNote: Re-released for DXP Platform.; PackageReference: RAD-0.3; Publisher: Altium Limited; PackageDescription: Radial Cap, Thru-Hole; 2 Leads; 0.3 in Pin Spacing; Ref.Farnell: ?/8820023; Supplier: Farnell
P8 = Header 2: as P10 on sheet LumSensor; LatestRevisionDate: 17-Jul-2002; LatestRevisionNote: Re-released for DXP Platform.; Publisher: Altium Limited; Ref.Farnell: 2112482; Supplier: Farnell
R41 = Res1: as R22 on sheet LedAlert; Published: 8-Jun-2000; LatestRevisionDate: 17-Jul-2002; LatestRevisionNote: Re-released for DXP Platform.; PackageReference: AXIAL-0.3; Publisher: Altium Limited; PackageDescription: Axial Device, Thru-Hole; 2 Leads; 0.3 in Pin Spacing; Ref.Farnell: ?; Supplier: Farnell
R42 = Res1: Resistor; Manufacturer: MULTICOMP; Ref.Manufacturer: MC0063W060311M; Value: 1K; Published: 8-Jun-2000; LatestRevisionDate: 17-Jul-2002; LatestRevisionNote: Re-released for DXP Platform.; PackageReference: AXIAL-0.3; Publisher: Altium Limited; PackageDescription: Axial Device, Thru-Hole; 2 Leads; 0.3 in Pin Spacing; Ref.Farnell: 9330410; Supplier: Farnell
S1 = SW-SPDT: SPDT Subminiature Toggle Switch, Right Angle Mounting, Vertical Actuation; Manufacturer: EOZ; Ref.Manufacturer: 09.03201.02; Published: 24-Mar-1999; LatestRevisionDate: 17-Dec-2003; LatestRevisionNote: Schematic revised, PCB Footprint replaced.; DatasheetVersion: 05-Dec-2000; PackageReference: TL36WW15050; Publisher: Altium Limited; PackageDescription: Switch; 4 Leads; ComponentLink1Description: Manufacturer Link; ComponentLink1URL: http://www.apem.com; Ref.Farnell: 1608080; Supplier: Farnell
U9 = LM1117D-33: Battery; Manufacturer: TEXAS INSTRUMENTS; Ref.Manufacturer: LM1117T-3.3/NOPB; Ref.Farnell: 1469056; Supplier: Farnell
D3 = Diode: Published: 8-Jun-2000; LatestRevisionDate: 17-Jul-2002; LatestRevisionNote: Re-released for DXP Platform.; PackageVersion: Sep-1996; PackageReference: SMC; Publisher: Altium Limited; PackageDescription: DO-214-AB/SMC; 2 C-Bend Leads; Body 7.9 x 5.9 mm, inc. leads (LxW); Code_JEDEC: DO-214-AB; Supplier: Farnell

## Nets that join several sheets
3.3V: PIC (6 pins), LumSensor (P10.1), Temperature (R37.2 U7.3), MCP23017 (R35.2 R36.2 U6.9 U6.18), Level Sensor (5 pins), LCD (R44.1 U5.2 U5.5 U5.15), BarGraph (6 pins), ModRadio (U4.2), Power (C7.2 U9.2 U9.4)
7.4V: Pump (D1.2 P1.1), Power (C6.2 R41.2 S1.2 U9.3)
GND: PIC (11 pins), LedAlert (D2.2), LumSensor (R38.2), Temperature (U7.1), MCP23017 (U6.10 U6.15 U6.16 U6.17), Level Sensor (5 pins), LCD (R44.3 U5.1), BarGraph (16 pins), SoilMoisture (P7.2), ModRadio (U4.1), Pump (Q1.3 R43.2), Power (6 pins)
Bat. Lvl.: PIC (J1.5 U8.5), Power (R41.1 R42.2)
CE: PIC (U8.15), ModRadio (U4.3)
Electrode0: MCP23017 (U6.21), Level Sensor (R25.2)
Electrode1: MCP23017 (U6.22), Level Sensor (R27.2)
Electrode2: MCP23017 (U6.23), Level Sensor (R29.2)
Electrode3: MCP23017 (U6.24), Level Sensor (R31.2)
Electrode4: MCP23017 (U6.25), Level Sensor (R33.2)
I2C0: PIC (U8.18), MCP23017 (R35.1 U6.12)
I2C1: PIC (U8.17), MCP23017 (R36.1 U6.13)
LCD0: MCP23017 (U6.1), LCD (U5.7)
LCD1: MCP23017 (U6.2), LCD (U5.8)
LCD2: MCP23017 (U6.3), LCD (U5.9)
LCD3: MCP23017 (U6.4), LCD (U5.10)
LCD4: MCP23017 (U6.5), LCD (U5.11)
LCD5: MCP23017 (U6.6), LCD (U5.12)
LCD6: MCP23017 (U6.7), LCD (U5.13)
LCD7: MCP23017 (U6.8), LCD (U5.14)
LCD8: MCP23017 (U6.26), LCD (U5.4)
LCD9: MCP23017 (U6.27), LCD (U5.6)
LCD10: MCP23017 (U6.28), LCD (R21.2)
LED0: PIC (U8.6), LedAlert (R22.2)
LED1: PIC (U8.14), LedAlert (R23.2)
LED2: PIC (U8.7), LedAlert (R24.2)
Lum: PIC (U8.2), LumSensor (P10.2 R38.1)
MoistSensor: PIC (U8.23), SoilMoisture (P7.1)
NetU4_8: PIC (U8.16), ModRadio (U4.8)
Pump: PIC (J1.4 U8.4), Pump (Q1.2 R43.1)
RD0: PIC (U8.3), BarGraph (U1.14)
RD1: PIC (U8.10), BarGraph (U1.12 U2.12 U3.12)
RD2: PIC (U8.9), BarGraph (U1.11 U2.11 U3.11)
SPI0: PIC (U8.22), ModRadio (U4.7)
SPI1: PIC (U8.24), ModRadio (U4.6)
SPI2: PIC (U8.25), ModRadio (U4.5)
SPI3: PIC (U8.26), ModRadio (U4.4)
Temp: PIC (U8.21), Temperature (R37.1 U7.2)